# EAGLE design mss-i2c (EAGLE 5.11)
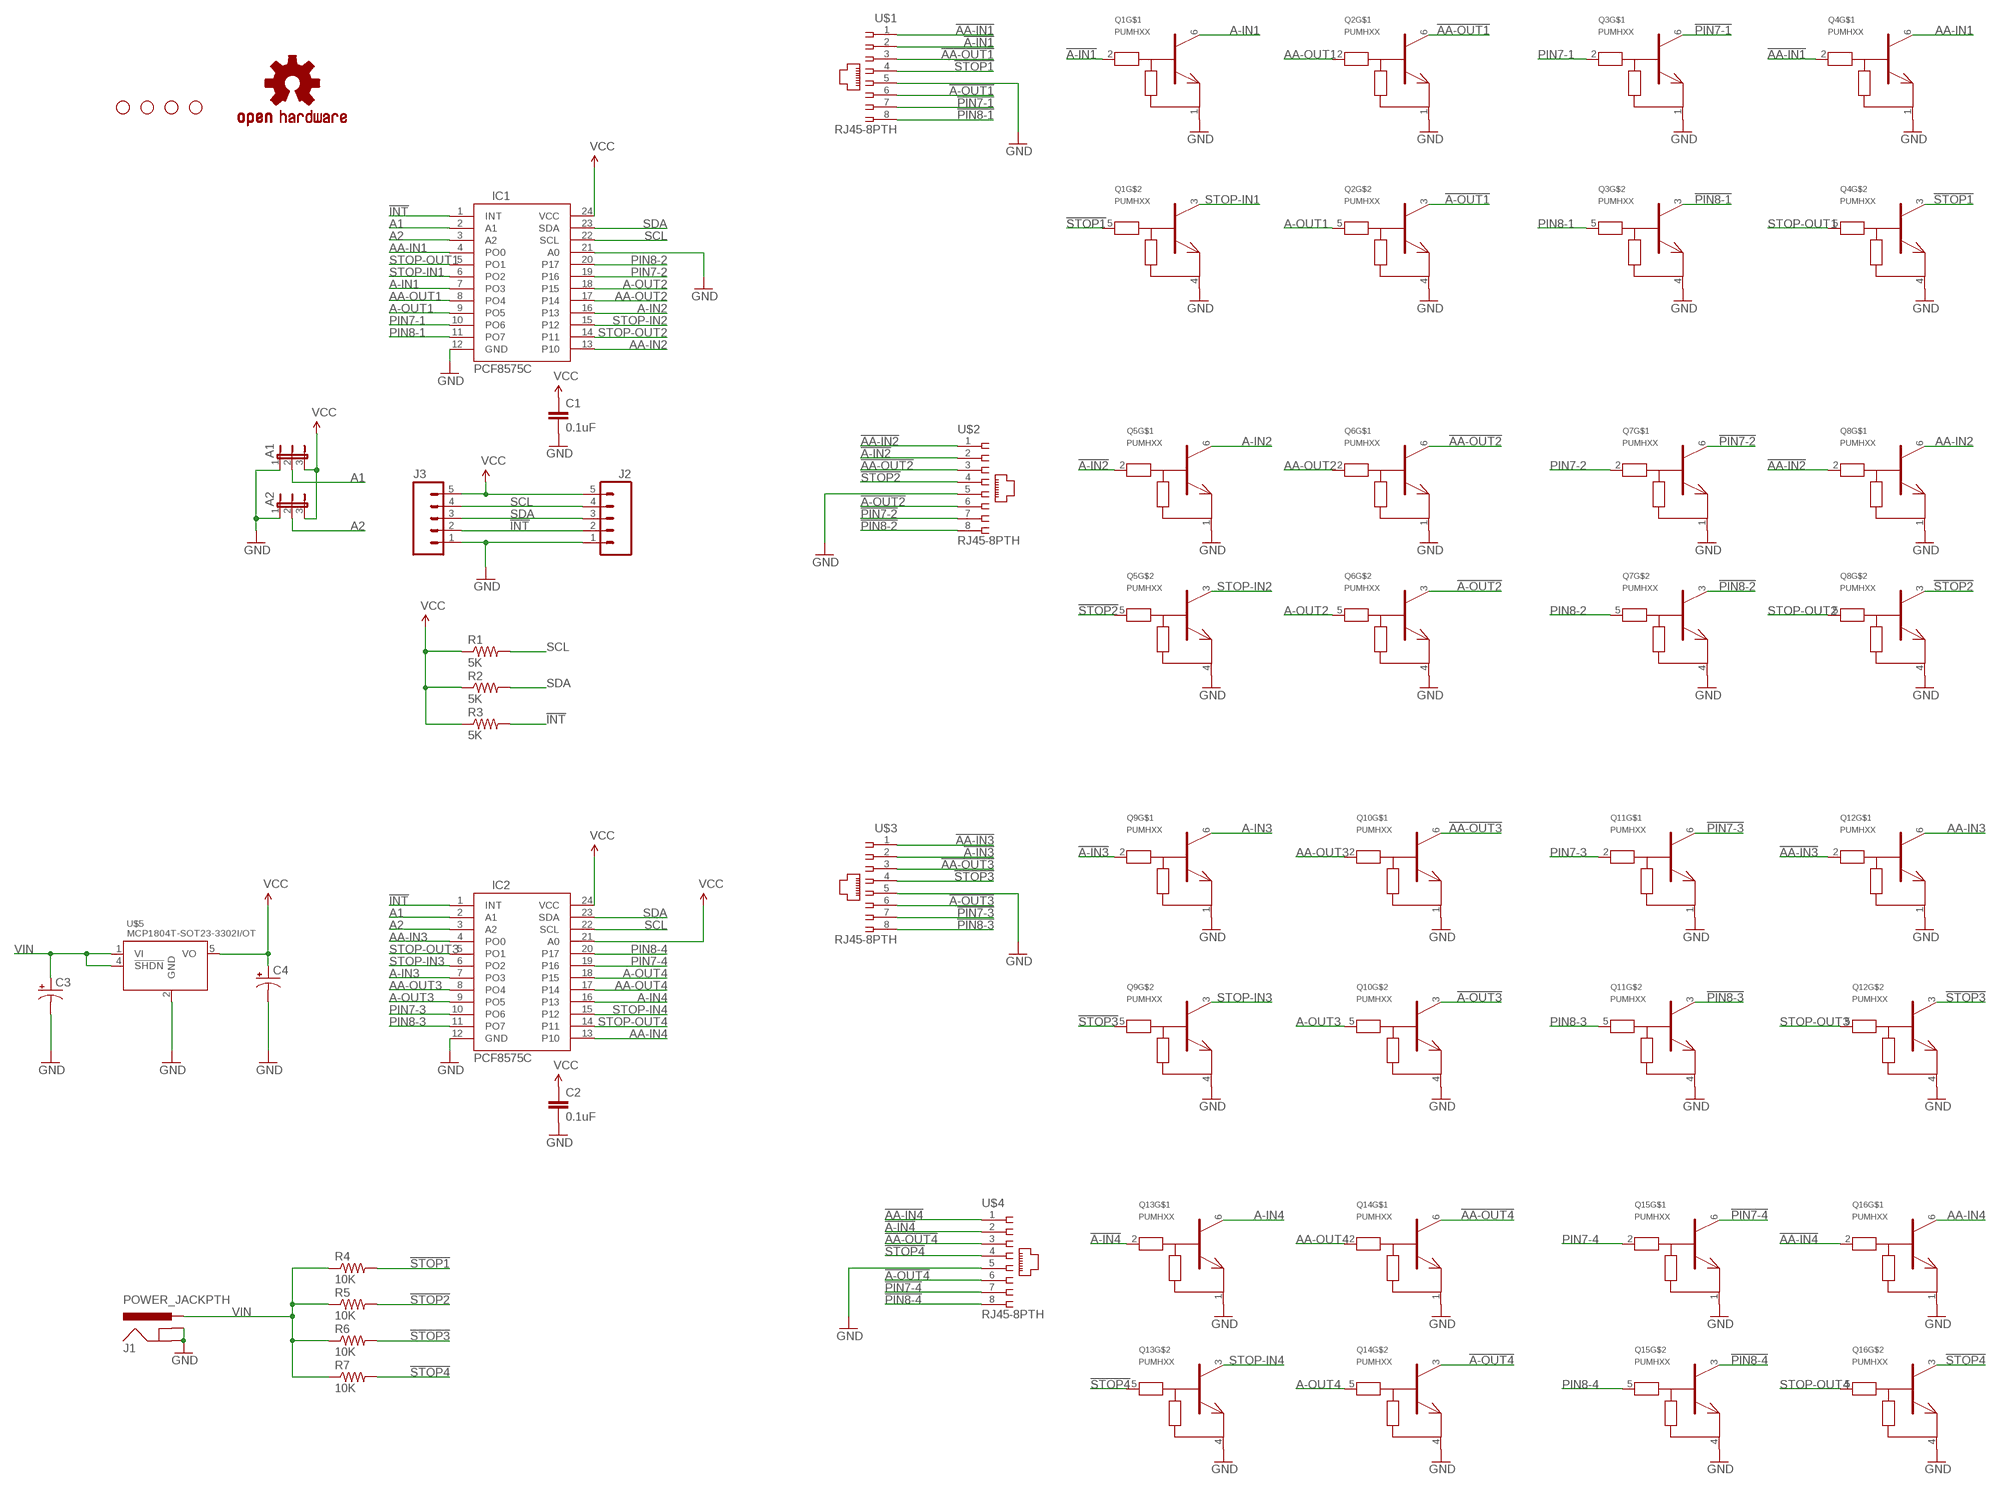
[diagram p0: schematic, sheet 1]

## Parts
A1  JP2E  [JP2]
A2  JP2E  [JP2]
C1  0.1uF  CAP0805  [0805]
C2  0.1uF  CAP0805  [0805]
C3  CAP_POL1206  [EIA3216]
C4  CAP_POL1206  [EIA3216]
IC1  PCF8575C  [SO-24DW]
IC2  PCF8575C  [SO-24DW]
J1  POWER_JACKPTH  [POWER_JACK_PTH]
J2  M05PTH  [1X05]
J3  M05PTH  [1X05]
JP5  STAND-OFF  [STAND-OFF]
JP6  STAND-OFF  [STAND-OFF]
JP7  STAND-OFF  [STAND-OFF]
JP8  STAND-OFF  [STAND-OFF]
OHW  OSHW-LOGOM  [OSHW-LOGO-M]
Q1  PUMHXX  [SOT363]
Q2  PUMHXX  [SOT363]
Q3  PUMHXX  [SOT363]
Q4  PUMHXX  [SOT363]
Q5  PUMHXX  [SOT363]
Q6  PUMHXX  [SOT363]
Q7  PUMHXX  [SOT363]
Q8  PUMHXX  [SOT363]
Q9  PUMHXX  [SOT363]
Q10  PUMHXX  [SOT363]
Q11  PUMHXX  [SOT363]
Q12  PUMHXX  [SOT363]
Q13  PUMHXX  [SOT363]
Q14  PUMHXX  [SOT363]
Q15  PUMHXX  [SOT363]
Q16  PUMHXX  [SOT363]
R1  5K  RESISTOR0805-RES  [0805]
R2  5K  RESISTOR0805-RES  [0805]
R3  5K  RESISTOR0805-RES  [0805]
R4  10K  RESISTOR0805-RES  [0805]
R5  10K  RESISTOR0805-RES  [0805]
R6  10K  RESISTOR0805-RES  [0805]
R7  10K  RESISTOR0805-RES  [0805]
U$1  RJ45-8PTH  215877-4  [215877-4]
U$2  RJ45-8PTH  215877-4  [215877-4]
U$3  RJ45-8PTH  215877-4  [215877-4]
U$4  RJ45-8PTH  215877-4  [215877-4]
U$5  MCP1804T-SOT23-3302I/OT  [SOT23-5L]

## Nets
!A-IN1: Q1.2(B) U$1.2
!A-IN2: Q5.2(B) U$2.2
!A-IN3: Q9.2(B) U$3.2
!A-IN4: Q13.2(B) U$4.2
!A-OUT1: Q2.3(C) U$1.6
!A-OUT2: Q6.3(C) U$2.6
!A-OUT3: Q10.3(C) U$3.6
!A-OUT4: Q14.3(C) U$4.6
!AA-IN1: Q4.2(B) U$1.1
!AA-IN2: Q8.2(B) U$2.1
!AA-IN3: Q12.2(B) U$3.1
!AA-IN4: Q16.2(B) U$4.1
!AA-OUT1: Q2.6(C) U$1.3
!AA-OUT2: Q6.6(C) U$2.3
!AA-OUT3: Q10.6(C) U$3.3
!AA-OUT4: Q14.6(C) U$4.3
!INT: IC1.1(INT) IC2.1(INT) J2.2 J3.2 R3.2
!PIN7-1: Q3.6(C) U$1.7
!PIN7-2: Q7.6(C) U$2.7
!PIN7-3: Q11.6(C) U$3.7
!PIN7-4: Q15.6(C) U$4.7
!PIN8-1: Q3.3(C) U$1.8
!PIN8-2: Q7.3(C) U$2.8
!PIN8-3: Q11.3(C) U$3.8
!PIN8-4: Q15.3(C) U$4.8
!STOP1: Q1.5(B) Q4.3(C) R4.2 U$1.4
!STOP2: Q5.5(B) Q8.3(C) R5.2 U$2.4
!STOP3: Q9.5(B) Q12.3(C) R6.2 U$3.4
!STOP4: Q13.5(B) Q16.3(C) R7.2 U$4.4
A1: A1.2 IC1.2(A1) IC2.2(A1)
A2: A2.2 IC1.3(A2) IC2.3(A2)
A-IN1: IC1.7(PO3) Q1.6(C)
A-IN2: IC1.16(P13) Q5.6(C)
A-IN3: IC2.7(PO3) Q9.6(C)
A-IN4: IC2.16(P13) Q13.6(C)
A-OUT1: IC1.9(PO5) Q2.5(B)
A-OUT2: IC1.18(P15) Q6.5(B)
A-OUT3: IC2.9(PO5) Q10.5(B)
A-OUT4: IC2.18(P15) Q14.5(B)
AA-IN1: IC1.4(PO0) Q4.6(C)
AA-IN2: IC1.13(P10) Q8.6(C)
AA-IN3: IC2.4(PO0) Q12.6(C)
AA-IN4: IC2.13(P10) Q16.6(C)
AA-OUT1: IC1.8(PO4) Q2.2(B)
AA-OUT2: IC1.17(P14) Q6.2(B)
AA-OUT3: IC2.8(PO4) Q10.2(B)
AA-OUT4: IC2.17(P14) Q14.2(B)
GND: A1.1 A2.1 C1.2 C2.2 C3.C(-) C4.C(-) IC1.12(GND) IC1.21(A0) IC2.12(GND) J1.GND J1.GNDBREAK J2.1 J3.1 Q1.1(E) Q1.4(E) Q2.1(E) Q2.4(E) Q3.1(E) Q3.4(E) Q4.1(E) Q4.4(E) Q5.1(E) Q5.4(E) Q6.1(E) Q6.4(E) Q7.1(E) Q7.4(E) Q8.1(E) Q8.4(E) Q9.1(E) Q9.4(E) Q10.1(E) Q10.4(E) Q11.1(E) Q11.4(E) Q12.1(E) Q12.4(E) Q13.1(E) Q13.4(E) Q14.1(E) Q14.4(E) Q15.1(E) Q15.4(E) Q16.1(E) Q16.4(E) U$1.5 U$2.5 U$3.5 U$4.5 U$5.2(GND)
PIN7-1: IC1.10(PO6) Q3.2(B)
PIN7-2: IC1.19(P16) Q7.2(B)
PIN7-3: IC2.10(PO6) Q11.2(B)
PIN7-4: IC2.19(P16) Q15.2(B)
PIN8-1: IC1.11(PO7) Q3.5(B)
PIN8-2: IC1.20(P17) Q7.5(B)
PIN8-3: IC2.11(PO7) Q11.5(B)
PIN8-4: IC2.20(P17) Q15.5(B)
SCL: IC1.22(SCL) IC2.22(SCL) J2.4 J3.4 R1.2
SDA: IC1.23(SDA) IC2.23(SDA) J2.3 J3.3 R2.2
STOP-IN1: IC1.6(PO2) Q1.3(C)
STOP-IN2: IC1.15(P12) Q5.3(C)
STOP-IN3: IC2.6(PO2) Q9.3(C)
STOP-IN4: IC2.15(P12) Q13.3(C)
STOP-OUT1: IC1.5(PO1) Q4.5(B)
STOP-OUT2: IC1.14(P11) Q8.5(B)
STOP-OUT3: IC2.5(PO1) Q12.5(B)
STOP-OUT4: IC2.14(P11) Q16.5(B)
VCC: A1.3 A2.3 C1.1 C2.1 C4.A(+) IC1.24(VCC) IC2.21(A0) IC2.24(VCC) J2.5 J3.5 R1.1 R2.1 R3.1 U$5.5(VO)
VIN: C3.A(+) J1.PWR R4.1 R5.1 R6.1 R7.1 U$5.1(VI) U$5.4(!SHDN)

## Library data of the parts
A1 A2 = jumper:JP2E: JUMPER
C1 C2 = SparkFun:CAP: Capacitor Standard 0603 ceramic capacitor, and 0.1" leaded capacitor.
C3 C4 = SparkFun:CAP_POL: Capacitor Polarized These are standard SMD and PTH capacitors. Normally 10uF, 47uF, and 100uF in electrolytic and tantalum varieties. Always verify the external diameter of the through hole cap, it varies with capacity, voltage, and manufacturer. The EIA devices should be standard.
IC1 IC2 = SparkFun:PCF8575C: PCF8575C I/O Expander.
J1 = SparkFun:POWER_JACK: Power Jack This is the standard 5.5mm barrel jack for power. The PTH is the most common, proven, reliable, footprint. All others are experimental. The Slot footprint only works if the mill layer is transmitted to the PCB fab house so be warned. Spark Fun Electronics SKU : PRT-00119. Mating wall wart : TOL-00298 (and others)
J2 J3 = SparkFun:M05: Header 5 Standard 5-pin 0.1" header. Use with straight break away headers (SKU : PRT-00116), right angle break away headers (PRT-00553), swiss pins (PRT-00743), machine pins (PRT-00117), and female headers (PRT-00115). Molex polarized connector foot print use with SKU : PRT-08230 with associated crimp pins and housings.
JP5-JP8 = SparkFun:STAND-OFF: Stand Off This is the mechanical footprint for a #4 phillips button head screw. Use the keepout ring to avoid running the screw head into surrounding components. SKU : PRT-00447
OHW = SparkFun:OSHW-LOGO: Open Source Hardware Logo This logo indicates the piece of hardware it is found on incorporates a OSHW license and/or adheres to the definition of open source hardware found here: http://freedomdefined.org/OSHW
Q1-Q16 = nxp-ret:PUMHXX
R1-R7 = SparkFun:RESISTOR: Resistor Basic schematic elements and footprints for 0603, 1206, and PTH resistors.
U$1-U$4 = con-amp:215877-4: AMP connector; OC_FARNELL: unknown; OC_NEWARK: unknown
U$5 = mcp1804:MCP1804T-SOT23

## Board
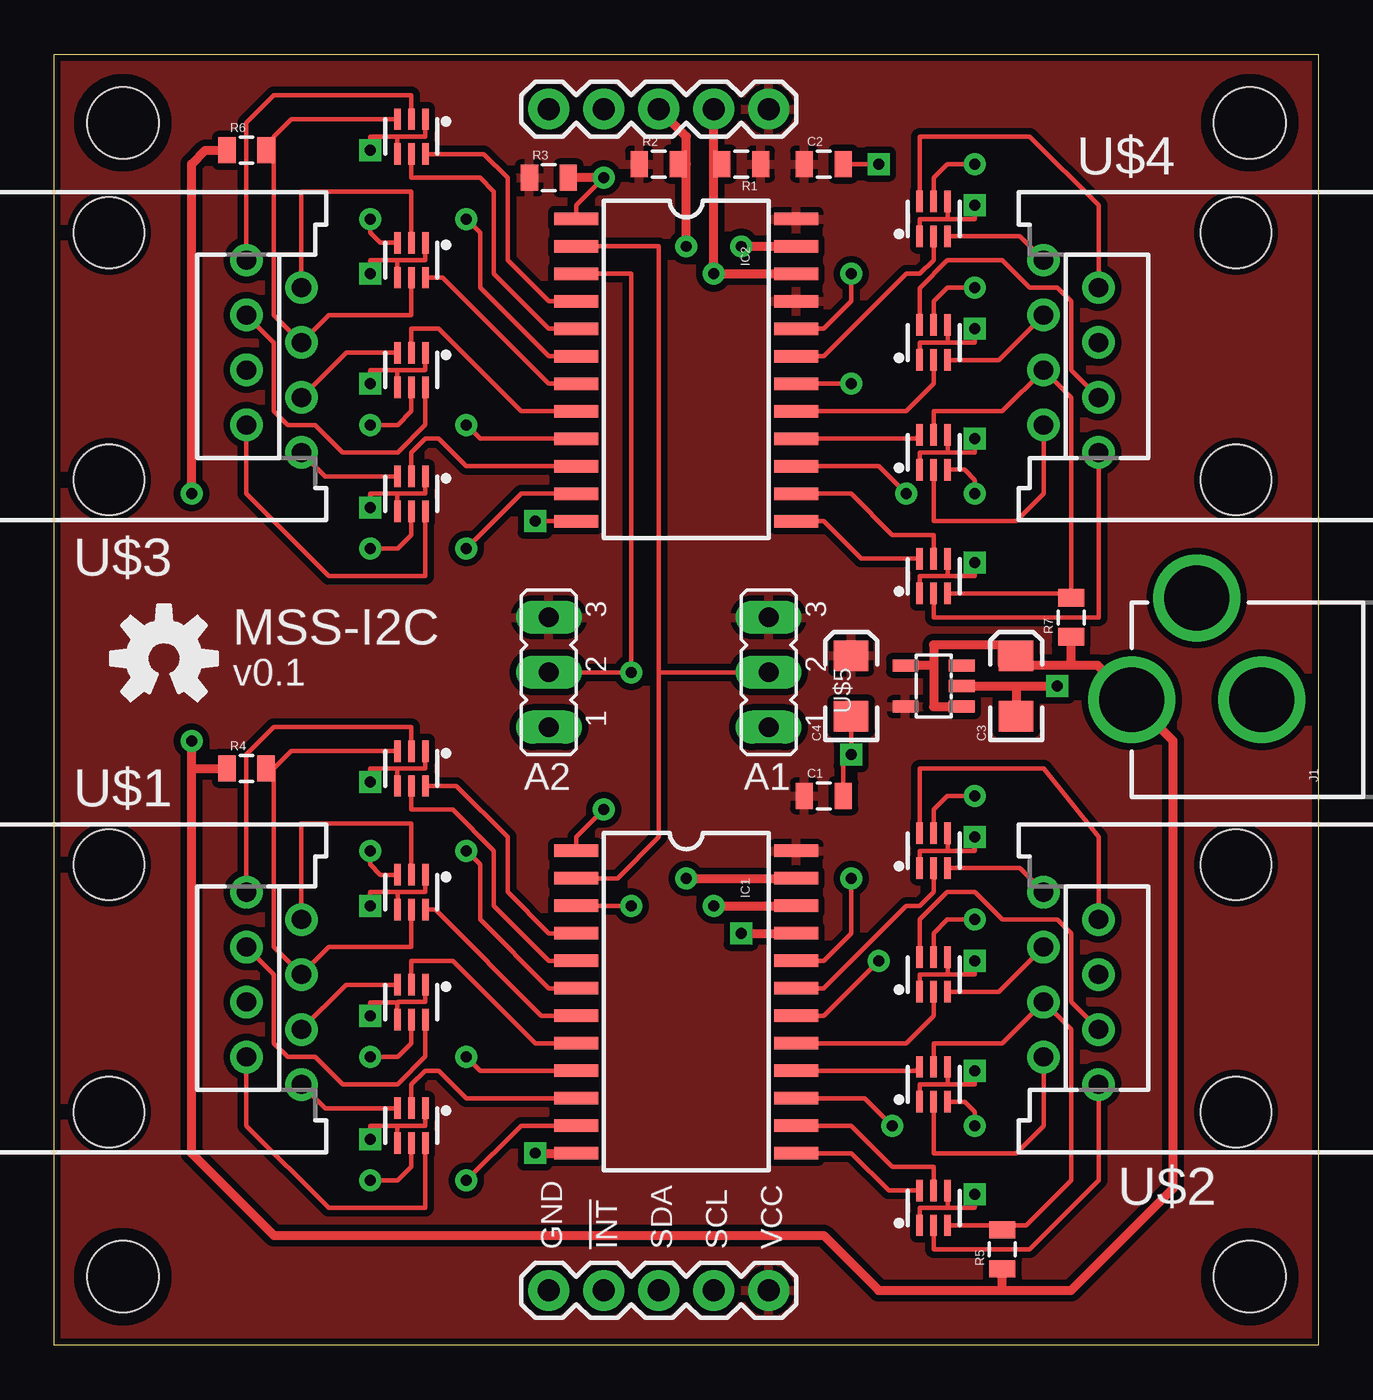
[diagram p1: board, top side]
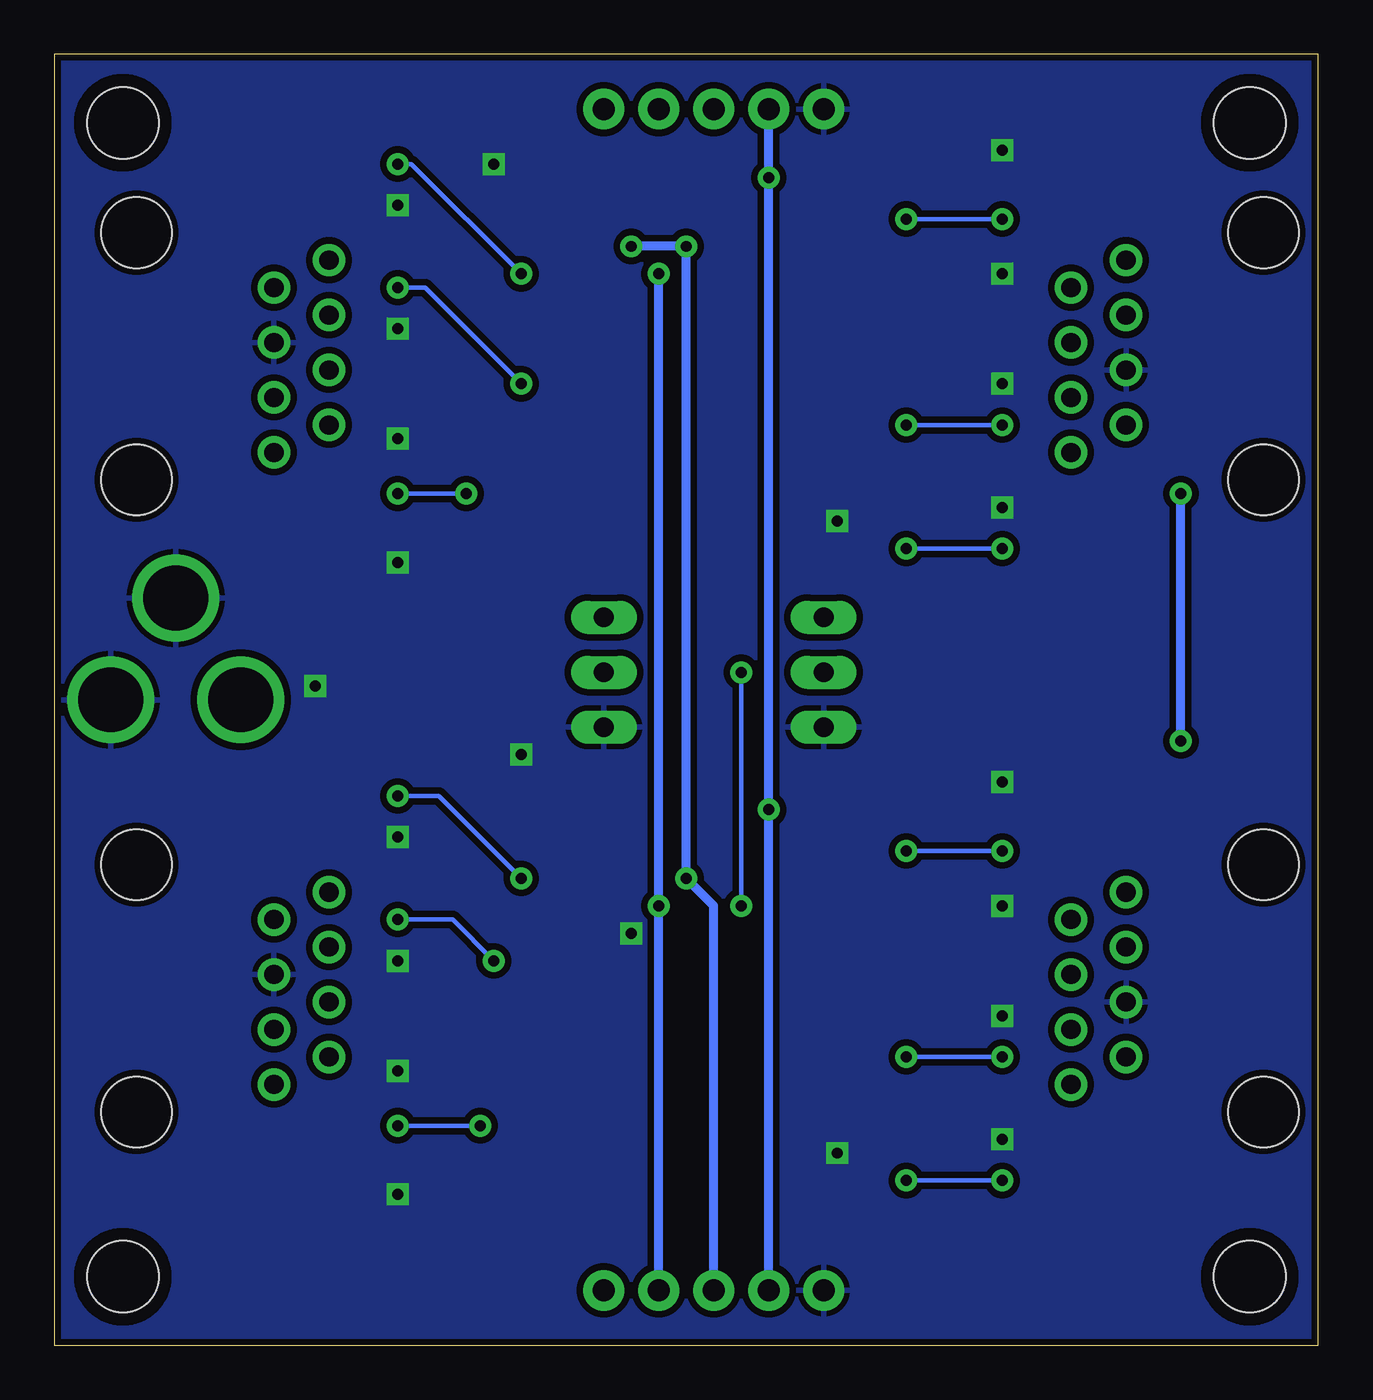
[diagram p2: board, bottom side, seen from below]

Size 58.42 x 59.69 mm. Coordinates in mm from the lower left corner, seen from the top.
Outline: 0,0 0,59.69 58.42,59.69 58.42,0 0,0
Copper layers (1*16): Top 0.035mm / dielectric 1.5mm / Bottom 0.035mm
Design rules "SparkFun": minimum track width 8mil, minimum drill 20mil, track to track 8mil, track to pad 8mil, pad to pad 8mil, via to via 8mil, smd to smd 8mil, copper to edge 10mil, drill to drill 8mil, minimum pad ring 12mil, minimum via ring 10mil, stop-mask expansion 4mil, vias tented up to drill 25mil, thermal gap 10mil

### Footprints (pad centres in the part's own frame; a part is rotated, then mirrored left to right if it is on the bottom)
JP2 = drill 0.914 long: 1 -2.54,0; 2 0,0; 3 2.54,0
0805 = smd 0.8 x 1.2: 1 -0.9,0; 2 0.9,0
EIA3216 = smd 1.4 x 1.6: A 1.4,0; C -1.4,0
SO-24DW = smd 0.584 x 2.032: 1 -6.35,-5.08; 2 -5.08,-5.08; 3 -3.81,-5.08; 4 -2.54,-5.08; 5 -1.27,-5.08; 6 0,-5.08; 7 1.27,-5.08; 8 2.54,-5.08; 9 3.81,-5.08; 10 5.08,-5.08; 11 6.35,-5.08; 12 7.62,-5.08; 13 7.62,5.08; 14 6.35,5.08; 15 5.08,5.08; 16 3.81,5.08; 17 2.54,5.08; 18 1.27,5.08; 19 0,5.08; 20 -1.27,5.08; 21 -2.54,5.08; 22 -3.81,5.08; 23 -5.08,5.08; 24 -6.35,5.08
POWER_JACK_PTH = drill 2.997 round: GND 0,7.7; GNDBREAK 4.7,10.7; PWR 0,13.7
1X05 = drill 1.016 pad 1.88 round: 1 0,0; 2 2.54,0; 3 5.08,0; 4 7.62,0; 5 10.16,0
STAND-OFF = hole 3.302: 0,0
SOT363 = smd 0.3 x 0.99: 1 -0.65,-0.8; 2 0,-0.8; 3 0.65,-0.8; 4 0.65,0.81; 5 0,0.81; 6 -0.65,0.81
215877-4 = drill 0.889 round: 1 -4.445,6.35; 2 -3.175,8.89; 3 -1.905,6.35; 4 -0.635,8.89; 5 0.635,6.35; 6 1.905,8.89; 7 3.175,6.35; 8 4.445,8.89 | hole 3.251: -5.715,0; 5.715,0
SOT23-5L = smd 0.55 x 1.2: 1 -0.95,-1.3; 2 0,-1.3; 3 0.95,-1.3; 4 0.95,1.3; 5 -0.95,1.3

### Placement (x,y rotation side)
A1  33.02,31.11 90 top
A2  22.86,31.11 90 top
C1  35.56,25.4 0 top
C2  35.56,54.61 0 top
C3  44.45,30.48 90 top
C4  36.83,30.48 90 top
IC1  29.21,16.51 270 top
IC2  29.21,45.72 270 top
J1  63.5,29.84 90 top
J2  22.86,57.15 0 top
J3  22.86,2.54 0 top
JP5  55.24,3.17 90 top
JP6  3.17,3.17 90 top
JP7  3.17,56.52 90 top
JP8  55.24,56.52 0 top
OHW  5.08,31.75 0 top
Q1  16.51,20.95 180 top
Q2  16.51,15.88 180 top
Q3  16.51,10.16 180 top
Q4  16.51,26.67 180 top
Q5  40.64,12.06 0 top
Q6  40.64,17.14 0 top
Q7  40.64,22.86 0 top
Q8  40.64,6.35 0 top
Q9  16.51,50.16 180 top
Q10  16.51,45.09 180 top
Q11  16.51,39.37 180 top
Q12  16.51,55.88 180 top
Q13  40.64,41.27 0 top
Q14  40.64,46.35 0 top
Q15  40.64,52.07 0 top
Q16  40.64,35.56 0 top
R1  31.75,54.61 180 top
R2  27.94,54.61 0 top
R3  22.86,53.98 0 top
R4  8.89,26.67 0 top
R5  43.81,4.45 90 top
R6  8.89,55.24 0 top
R7  46.99,33.66 90 top
U$1  2.54,16.51 270 top
U$2  54.61,16.51 90 top
U$3  2.54,45.72 270 top
U$4  54.61,45.72 90 top
U$5  40.64,30.48 90 top

### Tracks (layer width: path | path; a pad name or v marks a point on that pad's centre or on a via)
!A-IN1
  Top 0.203: Q1.2 16.51,24.13 11.43,24.13 U$1.2
!A-IN2
  Top 0.203: Q5.2 40.64,8.89 44.45,8.89 45.72,10.16 U$2.2
!A-IN3
  Top 0.203: U$3.2 11.43,53.34 16.51,53.34 Q9.2
!A-IN4
  Top 0.203: U$4.2 45.72,39.37 44.45,38.1 40.64,38.1 Q13.2
!A-OUT1
  Top 0.203: Q2.3 13.5,16.68 U$1.6
!A-OUT2
  Top 0.203: Q6.3 43.65,16.34 U$2.6
!A-OUT3
  Top 0.203: Q10.3 13.5,45.88 U$3.6
!A-OUT4
  Top 0.203: Q14.3 43.65,45.55 U$4.6
!AA-IN1
  Top 0.203: Q4.2 16.51,28.57 10.16,28.57 8.89,27.3 U$1.1
!AA-IN2
  Top 0.203: Q8.2 40.64,4.45 45.09,4.45 48.26,7.62 U$2.1
!AA-IN3
  Top 0.203: Q12.2 16.51,57.78 10.16,57.78 8.89,56.52 U$3.1
!AA-IN4
  Top 0.203: Q16.2 40.64,33.66 48.26,33.66 U$4.1
!AA-OUT1
  Top 0.203: Q2.6 17.16,13.35 15.88,12.06 13.34,12.06 12.06,13.34 10.79,13.34 10.16,13.97 10.16,17.14 U$1.3
!AA-OUT2
  Top 0.203: Q6.6 39.99,19.68 41.26,20.95 42.55,20.95 43.81,19.68 46.35,19.68 46.99,19.05 46.99,15.88 U$2.3
!AA-OUT3
  Top 0.203: Q10.6 17.16,42.56 15.88,41.27 13.34,41.27 12.06,42.55 10.79,42.55 10.16,43.18 10.16,46.35 U$3.3
!AA-OUT4
  Top 0.203: Q14.6 39.99,48.88 41.27,50.16 43.81,50.16 45.09,48.9 46.35,48.9 46.99,48.26 46.99,45.09 U$4.3
!INT  (via drill 0.51)
  Top 0.203: IC1.1 24.13,23.5 v25.4,24.77 | IC2.1 24.13,52.7 v25.4,53.98
  Top 0.406: v25.4,53.98 R3.2
  Bottom 0.406: J3.2 v25.4,24.77 v25.4,53.98 J2.2
!PIN7-1
  Top 0.203: Q3.6 17.16,6.35 12.7,6.35 8.89,10.16 U$1.7
!PIN7-2
  Top 0.203: Q7.6 39.99,26.67 45.72,26.67 48.26,23.5 U$2.7
!PIN7-3
  Top 0.203: Q11.6 17.16,35.56 12.7,35.56 8.89,39.37 U$3.7
!PIN7-4
  Top 0.203: Q15.6 39.99,55.87 40.01,55.88 45.09,55.88 48.26,52.7 U$4.7
!PIN8-1
  Top 0.203: Q3.3 12.54,10.96 U$1.8
!PIN8-2
  Top 0.203: Q7.3 44.62,22.06 U$2.8
!PIN8-3
  Top 0.203: Q11.3 12.54,40.17 U$3.8
!PIN8-4
  Top 0.203: Q15.3 44.62,51.27 U$4.8
!STOP1
  Top 0.203: Q1.5 16.51,18.41 12.7,18.41 U$1.4 10.16,18.41 10.16,26.67 | Q4.3 10.96,27.47 10.16,26.67 | 10.16,26.67 R4.2
!STOP2
  Top 0.203: Q5.5 40.64,13.97 43.81,13.97 U$2.4 46.99,14.61 46.99,7.62 44.92,5.55 43.81,5.55 | Q8.3 43.81,5.55 | 43.81,5.55 R5.2
!STOP3
  Top 0.203: Q9.5 16.51,47.62 12.7,47.62 U$3.4 10.16,47.62 10.16,55.24 | Q12.3 10.96,56.68 10.16,55.88 10.16,55.24 | 10.16,55.24 R6.2
!STOP4
  Top 0.203: Q16.3 46.99,34.76 R7.2 46.99,43.81 U$4.4 43.81,43.18 40.64,43.18 Q13.5
A1
  Top 0.203: IC2.2 27.94,50.8 27.94,31.11 | 27.94,31.11 27.94,23.5 26.04,21.59 IC1.2 | 27.94,31.11 A1.2
A2  (via drill 0.51)
  Top 0.203: IC2.3 26.67,49.53 v26.67,31.11 A2.2 | IC1.3 v26.67,20.32
  Bottom 0.203: v26.67,20.32 v26.67,31.11
A-IN1
  Top 0.203: Q1.6 17.61,20.14 22.51,15.24 IC1.7
A-IN2
  Top 0.203: IC1.16 39.81,12.7 Q5.6
A-IN3
  Top 0.203: 17.61,49.35 Q9.6 17.95,49.35 22.86,44.45 IC2.7
A-IN4
  Top 0.203: IC2.16 39.81,41.91 Q13.6
A-OUT1  (via drill 0.51)
  Top 0.203: Q2.5 16.51,13.97 15.88,13.34 v14.61,13.34 | IC1.9 19.68,12.7 v19.05,13.34
  Bottom 0.203: v14.61,13.34 v19.05,13.34
A-OUT2  (via drill 0.51)
  Top 0.203: Q6.5 40.64,19.05 41.27,19.68 v42.55,19.68 | IC1.18 35.56,15.24 v38.1,17.78
  Bottom 0.203: v42.55,19.68 40.01,19.68 v38.1,17.78
A-OUT3  (via drill 0.51)
  Top 0.203: Q10.5 16.51,43.18 15.88,42.55 v14.61,42.55 | IC2.9 19.68,41.91 v19.05,42.55
  Bottom 0.203: v14.61,42.55 v19.05,42.55
A-OUT4  (via drill 0.51)
  Top 0.203: IC2.18 v36.83,44.45 | Q14.5 40.64,48.26 41.27,48.9 v42.55,48.9
  Bottom 0.203: v42.55,48.9 41.27,48.9 v36.83,44.45
AA-IN1
  Top 0.203: IC1.4 22.86,19.05 20.95,20.95 20.95,23.5 18.59,25.86 Q4.6
AA-IN2
  Top 0.203: IC1.13 36.83,8.89 38.56,7.16 Q8.6
AA-IN3
  Top 0.203: IC2.4 22.86,48.26 20.95,50.16 20.95,53.98 19.86,55.07 Q12.6
AA-IN4
  Top 0.203: IC2.13 35.56,38.1 37.29,36.37 Q16.6
AA-OUT1
  Top 0.203: Q2.2 16.51,17.78 18.41,17.78 22.23,13.97 IC1.8
AA-OUT2
  Top 0.203: Q6.2 40.64,15.24 39.37,13.97 IC1.17
AA-OUT3
  Top 0.203: Q10.2 16.51,46.99 17.78,46.99 21.59,43.18 IC2.8
AA-OUT4
  Top 0.203: Q14.2 40.64,44.45 39.37,43.18 IC2.17
GND  (via drill 0.51)
  Top 0.203: Q2.4 15.86,15.86 | 15.86,15.86 15.88,15.88 17.14,15.88 17.14,16.66 Q2.1 | Q1.1 17.16,20.97 17.14,20.95 15.88,20.95 | 15.88,20.95 15.88,20.16 Q1.4 | 15.86,10.14 15.88,10.16 17.14,10.16 17.14,10.95 Q3.1 | 15.86,10.14 Q3.4 | 41.29,12.06 Q5.4 | Q5.1 39.99,12.06 41.29,12.06 | Q6.1 39.99,17.14 41.29,17.14 | Q7.1 39.99,22.86 41.29,22.86 | 41.29,17.14 Q6.4 | 41.29,22.86 Q7.4 | Q4.1 17.16,26.67 15.86,26.67 | 15.86,26.67 Q4.4 | Q8.1 39.99,6.35 41.29,6.35 | 41.29,6.35 Q8.4 | 15.86,39.37 Q11.4 | 15.86,39.37 17.16,39.37 Q11.1 | 15.86,45.09 Q10.4 | Q10.1 17.16,45.09 15.86,45.09 | Q9.1 17.16,50.16 15.86,50.16 | 15.86,50.16 Q9.4 | Q12.1 17.16,55.88 15.86,55.88 | 15.86,55.88 Q12.4 | v14.61,38.73 14.61,39.37 15.86,39.37 | v14.61,20.32 14.61,20.95 15.88,20.95 | v14.61,15.24 14.61,15.86 15.86,15.86 | v14.61,26.04 14.61,26.67 15.86,26.67 | v14.61,9.53 14.61,10.14 15.86,10.14 | v14.61,44.45 14.61,45.09 15.86,45.09 | v14.61,49.53 14.61,50.16 15.86,50.16 | v14.61,55.24 14.61,55.88 15.86,55.88 | v22.23,38.1 IC2.12 | Q15.1 39.99,52.07 41.29,52.07 | 41.29,52.07 Q15.4 | 41.29,52.07 42.55,52.07 v42.55,52.7 | Q14.1 39.99,46.35 41.29,46.35 | 41.29,46.35 42.55,46.35 v42.55,46.99 | 41.29,46.35 Q14.4 | v42.55,17.78 42.55,17.14 41.29,17.14 | Q13.1 39.99,41.27 41.29,41.27 | 41.29,41.27 42.55,41.27 v42.55,41.91 | 41.29,41.27 Q13.4 | Q16.1 39.99,35.56 41.29,35.56 | 41.29,35.56 42.55,35.56 v42.55,36.2 | 41.29,35.56 Q16.4 | v42.55,23.5 42.55,22.86 41.29,22.86 | v42.55,12.7 42.55,12.06 41.29,12.06 | v42.55,6.99 42.55,6.35 41.29,6.35 | C4.C v36.83,27.3 36.46,26.93 C1.2 | C2.2 v38.1,54.61
  Top 0.406: v22.23,8.89 IC1.12 | v31.75,19.05 IC1.21 | 44.45,30.48 v46.35,30.48 | 44.45,30.48 C3.C | U$5.2 44.45,30.48
  pour Bottom (isolate 0.305): 58.42,0 0,0 0,59.69 58.42,59.69
PIN7-1
  Top 0.203: Q3.2 16.51,12.06 17.14,12.7 17.78,12.7 19.05,11.43 IC1.10
PIN7-2
  Top 0.203: Q7.2 40.64,20.95 40.01,20.32 39.37,20.32 35.56,16.51 IC1.19
PIN7-3
  Top 0.203: Q11.2 16.51,41.27 17.14,41.91 17.78,41.91 19.05,40.64 IC2.10
PIN7-4
  Top 0.203: IC2.19 35.56,45.72 39.37,49.53 40.01,49.53 40.64,50.16 Q15.2
PIN8-1  (via drill 0.51)
  Top 0.203: Q3.5 16.51,8.26 15.88,7.62 v14.61,7.62 | IC1.11 21.59,10.16 v19.05,7.62
  Bottom 0.203: v14.61,7.62 v19.05,7.62
PIN8-2  (via drill 0.51)
  Top 0.203: Q7.5 40.64,24.77 41.27,25.4 v42.55,25.4 | v36.83,21.59 36.83,19.05 35.56,17.78 IC1.20
  Bottom 0.203: v42.55,25.4 40.64,25.4 v36.83,21.59
PIN8-3  (via drill 0.51)
  Top 0.203: Q11.5 16.51,37.47 15.88,36.83 v14.61,36.83 | IC2.11 21.59,39.37 v19.05,36.83
  Bottom 0.203: v14.61,36.83 v19.05,36.83
PIN8-4  (via drill 0.51)
  Top 0.203: IC2.20 35.56,46.99 36.83,48.26 v36.83,49.53 | Q15.5 40.64,53.98 41.27,54.61 v42.55,54.61
  Bottom 0.203: v42.55,54.61 41.91,54.61 v36.83,49.53
SCL  (via drill 0.51)
  Top 0.406: IC2.22 v30.48,49.53 30.48,54.61 | v30.48,20.32 IC1.22 | 30.48,54.61 J2.4 | 30.48,54.61 R1.2
  Bottom 0.406: J3.4 v30.48,20.32 v30.48,49.53
SDA  (via drill 0.51)
  Top 0.406: v29.21,21.59 IC1.23 | v31.75,50.8 IC2.23 | v29.21,50.8 29.21,54.61 | 29.21,54.61 29.21,55.88 J2.3 | 29.21,54.61 R2.2
  Bottom 0.406: J3.3 27.94,20.32 v29.21,21.59 v29.21,50.8 v31.75,50.8
STOP-IN1  (via drill 0.51)
  Top 0.203: v14.61,22.86 14.61,22.23 15.07,21.75 Q1.3 | IC1.6 22.86,16.51 19.68,19.68 19.68,22.23 v19.05,22.86
  Bottom 0.203: v14.61,22.86 v19.05,22.86
STOP-IN2  (via drill 0.51)
  Top 0.203: v42.55,10.16 42.55,10.79 42.08,11.27 Q5.3 | IC1.15 37.47,11.43 v38.73,10.16
  Bottom 0.203: v38.73,10.16 v42.55,10.16
STOP-IN3  (via drill 0.51)
  Top 0.203: Q9.3 15.07,50.97 14.61,51.44 v14.61,52.07 | IC2.6 22.86,45.72 19.68,48.9 19.68,51.44 v19.05,52.07
  Bottom 0.203: v14.61,52.07 v19.05,52.07
STOP-IN4  (via drill 0.51)
  Top 0.203: IC2.15 38.1,40.64 v39.37,39.37 | Q13.3 42.08,40.48 42.55,40.01 v42.55,39.37
  Bottom 0.203: v39.37,39.37 v42.55,39.37
STOP-OUT1
  Top 0.203: Q4.5 16.51,24.77 18.41,24.77 20.32,22.86 20.32,20.32 22.86,17.78 IC1.5
STOP-OUT2
  Top 0.203: Q8.5 40.64,8.26 38.73,8.26 36.83,10.16 IC1.14
STOP-OUT3
  Top 0.203: Q12.5 16.51,53.98 19.68,53.98 20.32,53.34 20.32,49.53 22.86,46.99 IC2.5
STOP-OUT4
  Top 0.203: IC2.14 36.83,39.37 38.73,37.47 40.64,37.47 Q16.5
VCC
  pour Top (isolate 0.305): 58.42,0 0,0 0,59.69 58.42,59.69
VIN  (via drill 0.51)
  Top 0.203: 44.45,31.43 C3.A
  Top 0.406: 46.99,31.43 R7.1 | 46.99,31.43 44.45,31.43 43.81,31.43 43.81,32.38 40.64,32.38 40.64,31.43 | 46.99,31.43 48.22,31.43 J1.PWR 51.7,27.94 51.7,7.25 46.99,2.54 43.81,2.54 | R6.1 6.99,55.24 6.35,54.61 v6.35,39.37 | 6.35,26.67 6.35,8.89 10.16,5.08 35.56,5.08 38.1,2.54 43.81,2.54 | 43.81,2.54 R5.1 | 6.35,26.67 R4.1 | 6.35,26.67 v6.35,27.94 | C3.A 44.45,31.78 | U$5.1 40.64,29.53 40.64,31.43 | 40.64,31.43 U$5.4
  Bottom 0.406: v6.35,27.94 v6.35,39.37

### Text on the board
tPlace: MSS-I2C | v0.1 | +9V | GND | !INT | SDA | SCL | VCC